# Altium schematic sheet power_supply.SchDoc
size A3
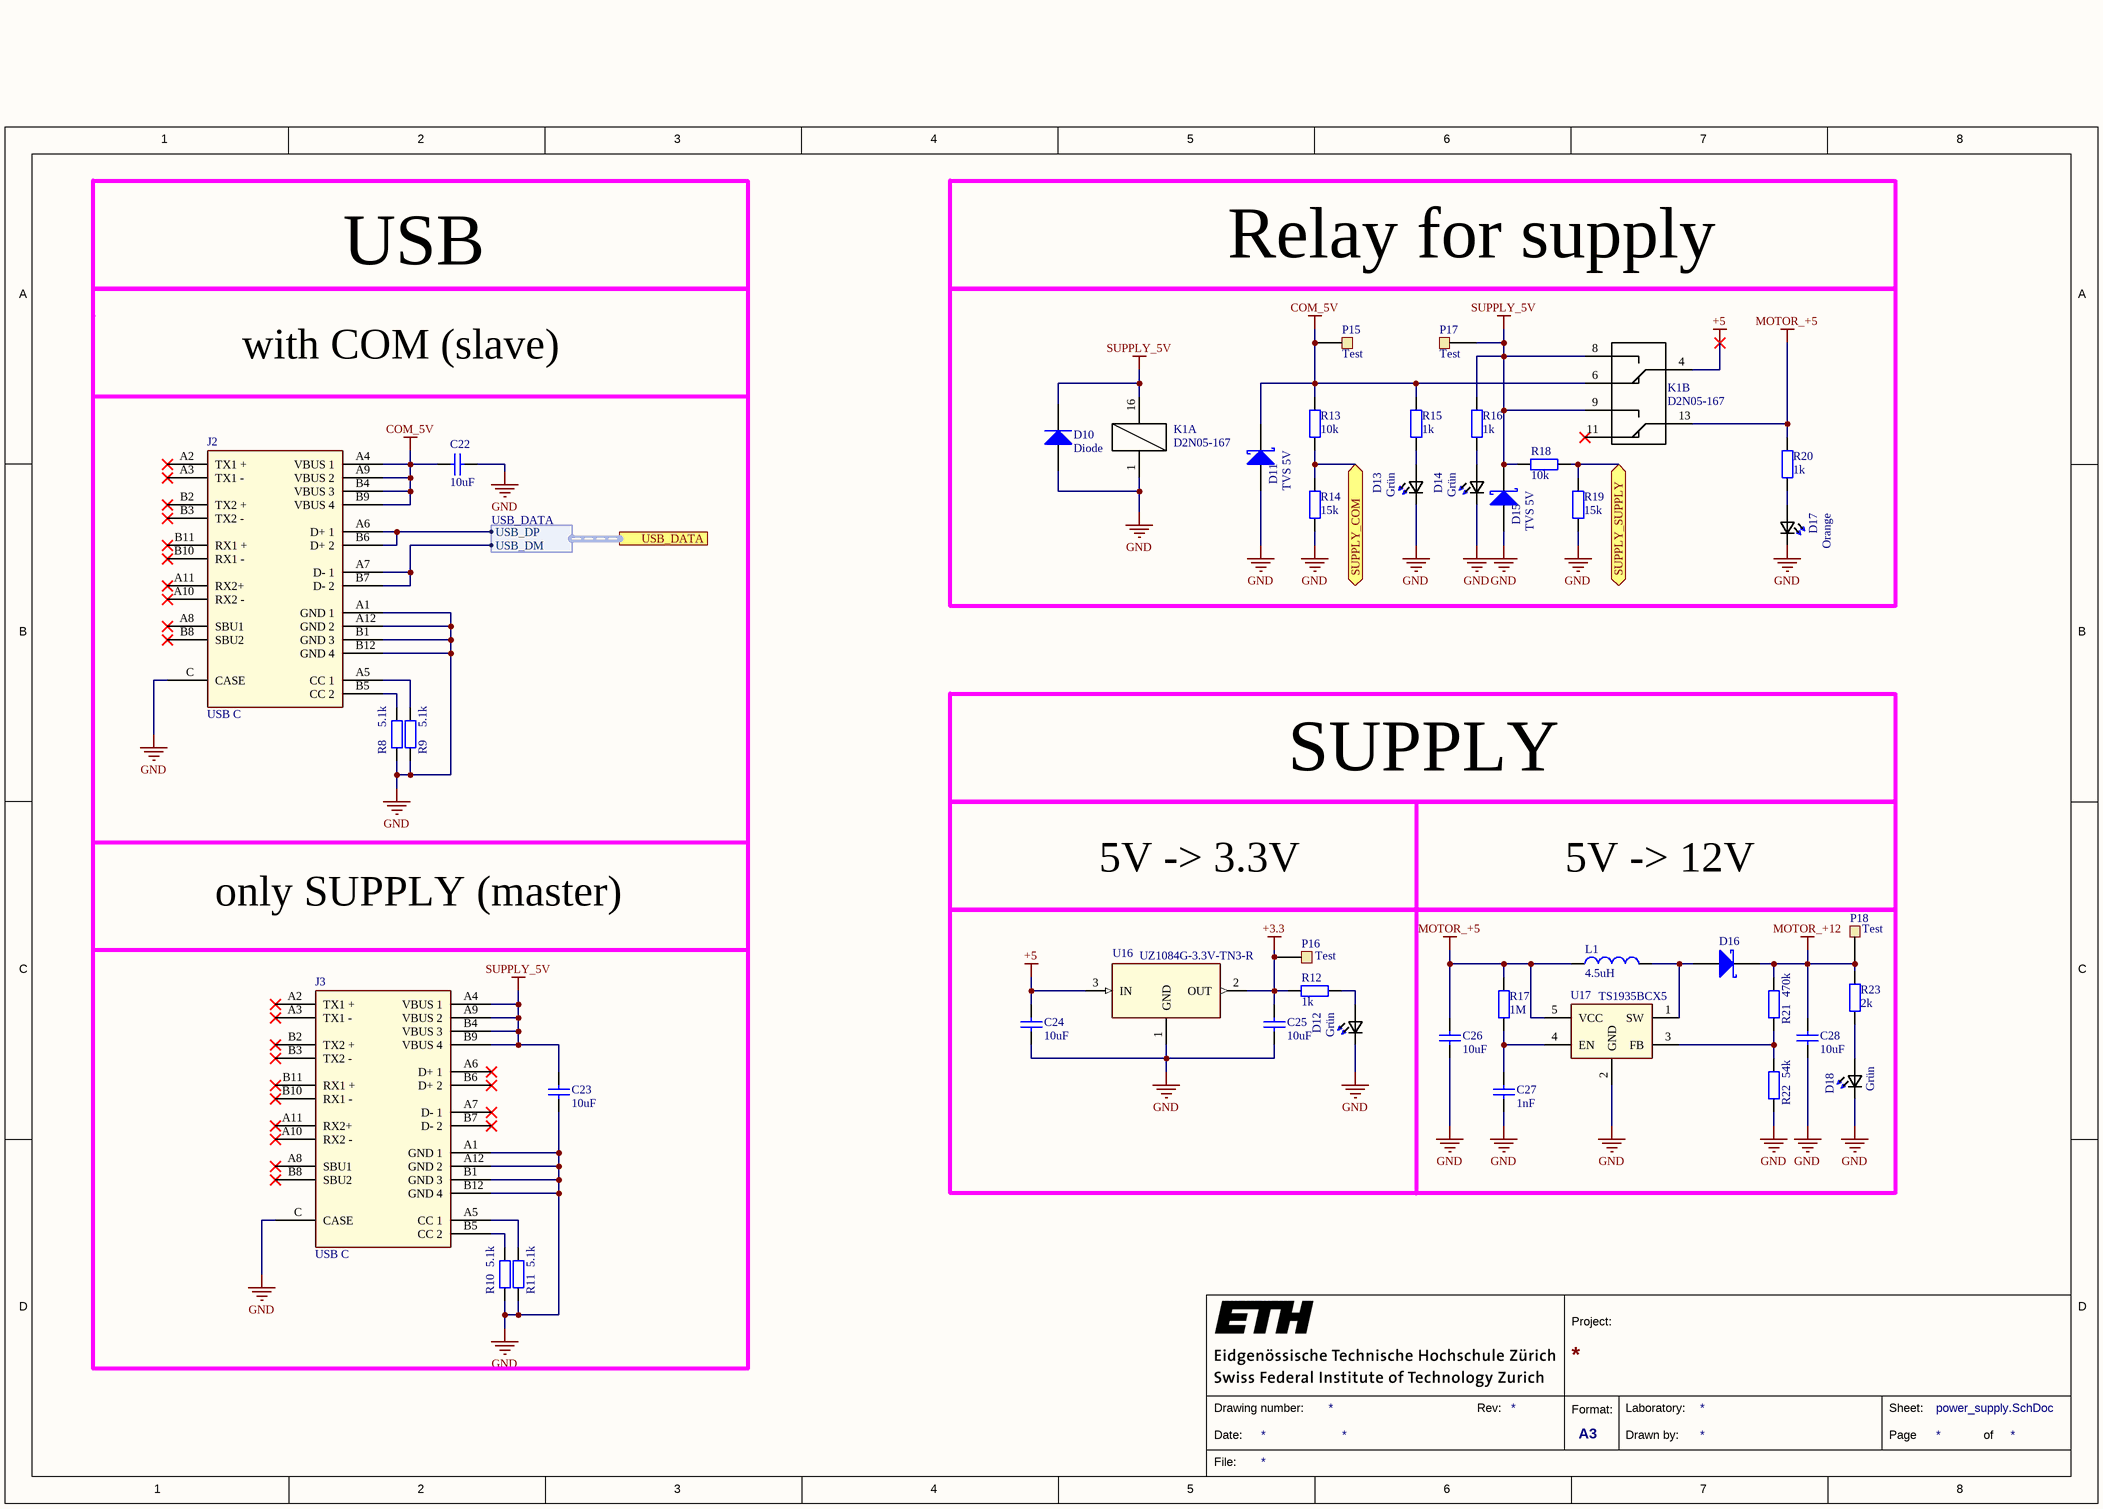
[diagram p0: power_supply.SchDoc]

## Parts
C22  10uF  [CAP_0603i_1608m -L]
C23  10uF  [CAP_0603i_1608m -L]
C24  10uF  [CAP_0603i_1608m -L]
C25  10uF  [CAP_0603i_1608m -L]
C26  10uF  [CAP_0603i_1608m -L]
C27  1nF  [CAP_0402i_1005m -N]
C28  10uF  [CAP_0603i_1608m -L]
D10  Diode  [SOD-323-N]
D11  TVS 5V  [SOD123]
D12  Grün  [*0603]
D13  Grün  [*0603]
D14  Grün  [*0603]
D15  TVS 5V  [SOD123]
D16  Diode  Schottky  [Diode SMA DO-214AC -N]  (value not drawn)
D17  Orange  [*0603]
D18  Grün  [*0603]
J2  USB C  [80211-1921]
J3  USB C  [80211-1921]
K1  D2N05-167  [D2N05-167]  (parts A,B of 2)
L1  4.5uH  [IND_0603i_1608m -L]
P15  Test  [PIN1]
P16  Test  [PIN1]
P17  Test  [PIN1]
P18  Test  [PIN1]
R8  5.1k  [RES_0603i_1608m -N]
R9  5.1k  [RES_0603i_1608m -N]
R10  5.1k  [RES_0603i_1608m -N]
R11  5.1k  [RES_0603i_1608m -N]
R12  1k  [RES_0603i_1608m -N]
R13  10k  [RES_0603i_1608m -N]
R14  15k  [RES_0603i_1608m -N]
R15  1k  [RES_0603i_1608m -N]
R16  1k  [RES_0603i_1608m -N]
R17  1M  [RES_0603i_1608m -N]
R18  10k  [RES_0603i_1608m -N]
R19  15k  [RES_0603i_1608m -N]
R20  1k  [RES_0603i_1608m -N]
R21  470k  [RES_0603i_1608m -N]
R22  54k  [RES_0603i_1608m -N]
R23  2k  [RES_0603i_1608m -N]
U16  UZ1084G-3.3V-TN3-R  [TO-252-2]
U17  TS1935BCX5  [*SOT95P285X145-5N]

## Blocks framed on the sheet
Relay for supply: D10 D11 D13-D15 D17 K1 P15 P17 R13-R16 R18-R20

## Ports
SUPPLY_COM (bidir), SUPPLY_SUPPLY (bidir), USB_DATA (harness USB_DATA)

## Harnesses
USB_DATA: USB_DP, USB_DM

## Nets
+3.3: C25.2 P16.1 R12.2 U16.2(OUT)
+5: C24.2 K1.4 U16.3(IN)
COM_5V: C22.2 D11.2(K) J2.A4(VBUS_1) J2.A9(VBUS_2) J2.B4(VBUS_3) J2.B9(VBUS_4) K1.6 P15.1 R13.2 R15.2
GND: C22.1 C23.2 C24.1 C25.1 C26.1 C27.1 C28.1 D10.1(A) D11.1(A) D12.1(K2) D13.1(K2) D14.1(K2) D15.1(A) D17.1(K2) D18.1(K2) J2.A1(GND_1) J2.A12(GND_2) J2.B1(GND_3) J2.B12(GND_4) J2.C(CASE) J3.A1(GND_1) J3.A12(GND_2) J3.B1(GND_3) J3.B12(GND_4) J3.C(CASE) K1.1 R8.2 R9.2 R10.2 R11.2 R14.1 R19.1 R22.2 U16.1(GND) U17.2(GND)
MOTOR_+5: C26.2 K1.13 L1.1 R17.1 R20.2 U17.5(VCC)
MOTOR_+12: C28.2 D16.2(K) P18.1 R21.1 R23.2
SUPPLY_5V: C23.1 D10.2(K) D15.2(K) J3.A4(VBUS_1) J3.A9(VBUS_2) J3.B4(VBUS_3) J3.B9(VBUS_4) K1.8 K1.9 K1.16 P17.1 R16.2 R18.1
SUPPLY_COM: R13.1 R14.2 ; port SUPPLY_COM
SUPPLY_SUPPLY: R18.2 R19.2 ; port SUPPLY_SUPPLY
NetC27_2: C27.2 R17.2 U17.4(EN)
NetD12_2: D12.2(A2) R12.1
NetD13_2: D13.2(A2) R15.1
NetD14_2: D14.2(A2) R16.1
NetD16_1: D16.1(A) L1.2 U17.1(SW)
NetD17_2: D17.2(A2) R20.1
NetD18_2: D18.2(A2) R23.1
NetJ2_A5: J2.A5(CC_1) R9.1
NetJ2_A6: J2.A6(D+_1) J2.B6(D+_2) ; port USB_DATA.USB_DP
NetJ2_A7: J2.A7(D-_1) J2.B7(D-_2) ; port USB_DATA.USB_DM
NetJ2_B5: J2.B5(CC_2) R8.1
NetJ3_A5: J3.A5(CC_1) R11.1
NetJ3_B5: J3.B5(CC_2) R10.1
NetR21_2: R21.2 R22.1 U17.3(FB)

Not connected (* = marked no-connect by the designer): J2 A2(TX1_+)* A3(TX1_-)* A8(SBU1)* A10(RX2_-)* A11(RX2+)* B2(TX2_+)* B3(TX2_-)* B8(SBU2)* B10(RX1_-)* B11(RX1_+)*; J3 A2(TX1_+)* A3(TX1_-)* A6(D+_1)* A7(D-_1)* A8(SBU1)* A10(RX2_-)* A11(RX2+)* B2(TX2_+)* B3(TX2_-)* B6(D+_2)* B7(D-_2)* B8(SBU2)* B10(RX1_-)* B11(RX1_+)*; K1 11*

## Notes on the sheet
- USB
- with COM (slave)
- SUPPLY
- only SUPPLY (master)
- 5V -> 3.3V
- 5V -> 12V
- 1
- 2
- 3
- 4
- 5
- 6
- 7
- 8
- A
- B
- C
- D
- Project:
- Date:
- Drawing number:
- Rev:
- Format:
- A3
- Drawn by:
- Laboratory:
- Page
- Sheet:
- of
- File:

## Library data of the parts
C22-C28 = Cap: capacitor
D10 = Diode: Default Diode
D11 D15 = Diode  Schottky: TVS Diode
D12-D14 D18 = LTST-C191KGKT: / LED; SMD; 0603; grün; 35mcd; 1.6x0.8x0.55mm; 130Â°; 2Ã·2.V; 20mA /; MF: Lite-On Inc.; Digi-Key_Purchase_URL: https://www.digikey.ch/product-detail/de/lite-on-inc/LTST-C191KGKT/160-1446-1-ND/386834; SnapEDA_Link: https://www.snapeda.com/parts/LTST-C191KFKT/Lite-On%20Inc./view-part/?ref=snap; MP: LTST-C191KGKT; Digi-Key_Part_Number: 160-1446-1-ND; Package: 0603 Lite-On; Value: *
D16 = Diode  Schottky: Schottky Diode
D17 = LTST-C191KFKT: / LED; SMD; 0603; orange; 45-90mcd; 1.6x0.8x0.55mm; 130Â°; 2Ã·2.4V; 20mA /; MF: Lite-On Inc.; Digi-Key_Purchase_URL: https://www.digikey.com/product-detail/en/lite-on-inc/LTST-C191KFKT/160-1445-1-ND/386832?utm_source=snapeda&utm_medium=aggregator&utm_campaign=symbol; SnapEDA_Link: https://www.snapeda.com/parts/LTST-C191KFKT/Lite-On%20Inc./view-part/?ref=snap; MP: LTST-C191KFKT; Digi-Key_Part_Number: 160-1445-1-ND; Package: 0603 Lite-On; Value: *
L1 = Inductor
P15-P18 = Pad: Single Pad or Testpoint
R8 R10 R12 R15 R16 R20 R23 = Res: Resistor
R9 R11 R13 R14 R17-R19 R21 R22 = Res
U16 = UZ1084G-3.3V-TN3-R: LINEAR VOLTAGE REGULATORS TO-252-2(DPAK) ROHS; MF: Diodes Inc.; MP: AZ1117D-3.3TRE1; Availability: Unavailable; SnapEDA_Link: https://www.snapeda.com/parts/AZ1117D-3.3TRE1/Diodes%20Inc./view-part/856390/?ref=snap; Package: TO-252-2 Diodes Inc.; Price: None; Value: *
U17 = TS1935BCX5: TS1935BCX5 Boost-Schaltregler Adj 1,9A 2,6-5,5Vi SOT23-5